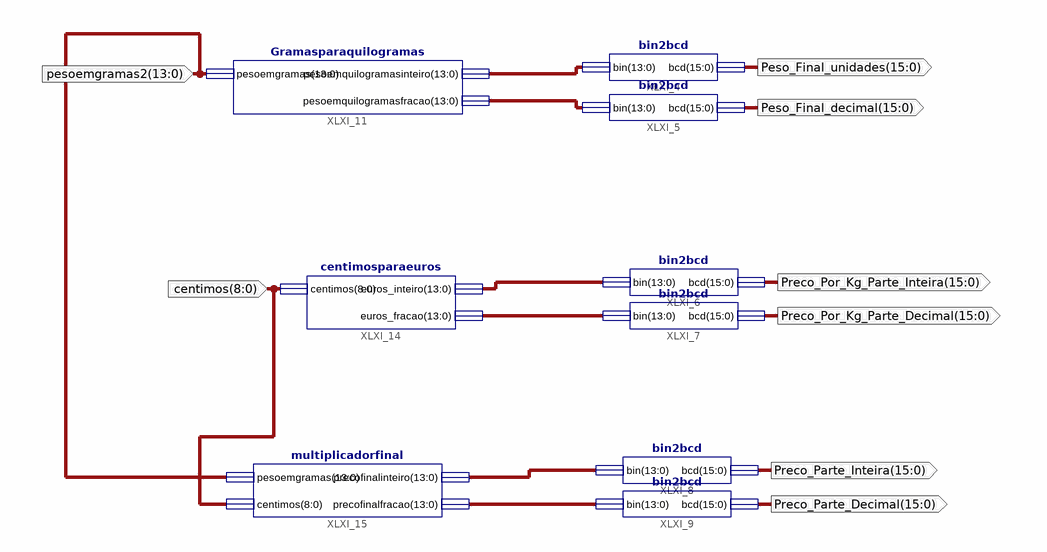
[diagram p0: schematic sheet 1]
// Xilinx ISE schematic projetof.sch (artix7) as structural Verilog: 9 symbols, 8 ports
module projetof (
  input  [13:0] pesoemgramas2,
  input  [8:0] centimos,
  output [15:0] Peso_Final_unidades,
  output [15:0] Peso_Final_decimal,
  output [15:0] Preco_Parte_Inteira,
  output [15:0] Preco_Parte_Decimal,
  output [15:0] Preco_Por_Kg_Parte_Inteira,
  output [15:0] Preco_Por_Kg_Parte_Decimal
);

  wire [13:0] euros_fracao, euros_inteiro, weightInKilogramsFraction, weightInKilogramsInteger, XLXN_20,
       XLXN_21;

  bin2bcd XLXI_4 (.bin(weightInKilogramsInteger), .bcd(Peso_Final_unidades));
  bin2bcd XLXI_5 (.bin(weightInKilogramsFraction), .bcd(Peso_Final_decimal));
  bin2bcd XLXI_6 (.bin(euros_inteiro), .bcd(Preco_Por_Kg_Parte_Inteira));
  bin2bcd XLXI_7 (.bin(euros_fracao), .bcd(Preco_Por_Kg_Parte_Decimal));
  bin2bcd XLXI_8 (.bin(XLXN_20), .bcd(Preco_Parte_Inteira));
  bin2bcd XLXI_9 (.bin(XLXN_21), .bcd(Preco_Parte_Decimal));
  Gramasparaquilogramas XLXI_11 (
    .pesoemgramas(pesoemgramas2), .pesoemquilogramasinteiro(weightInKilogramsInteger),
    .pesoemquilogramasfracao(weightInKilogramsFraction));
  centimosparaeuros XLXI_14 (.centimos(centimos), .euros_inteiro(euros_inteiro), .euros_fracao(euros_fracao));
  multiplicadorfinal XLXI_15 (
    .pesoemgramas(pesoemgramas2), .centimos(centimos), .precofinalinteiro(XLXN_20), .precofinalfracao(XLXN_21));
endmodule
